# EAGLE design due canshield (EAGLE 9.3.0)
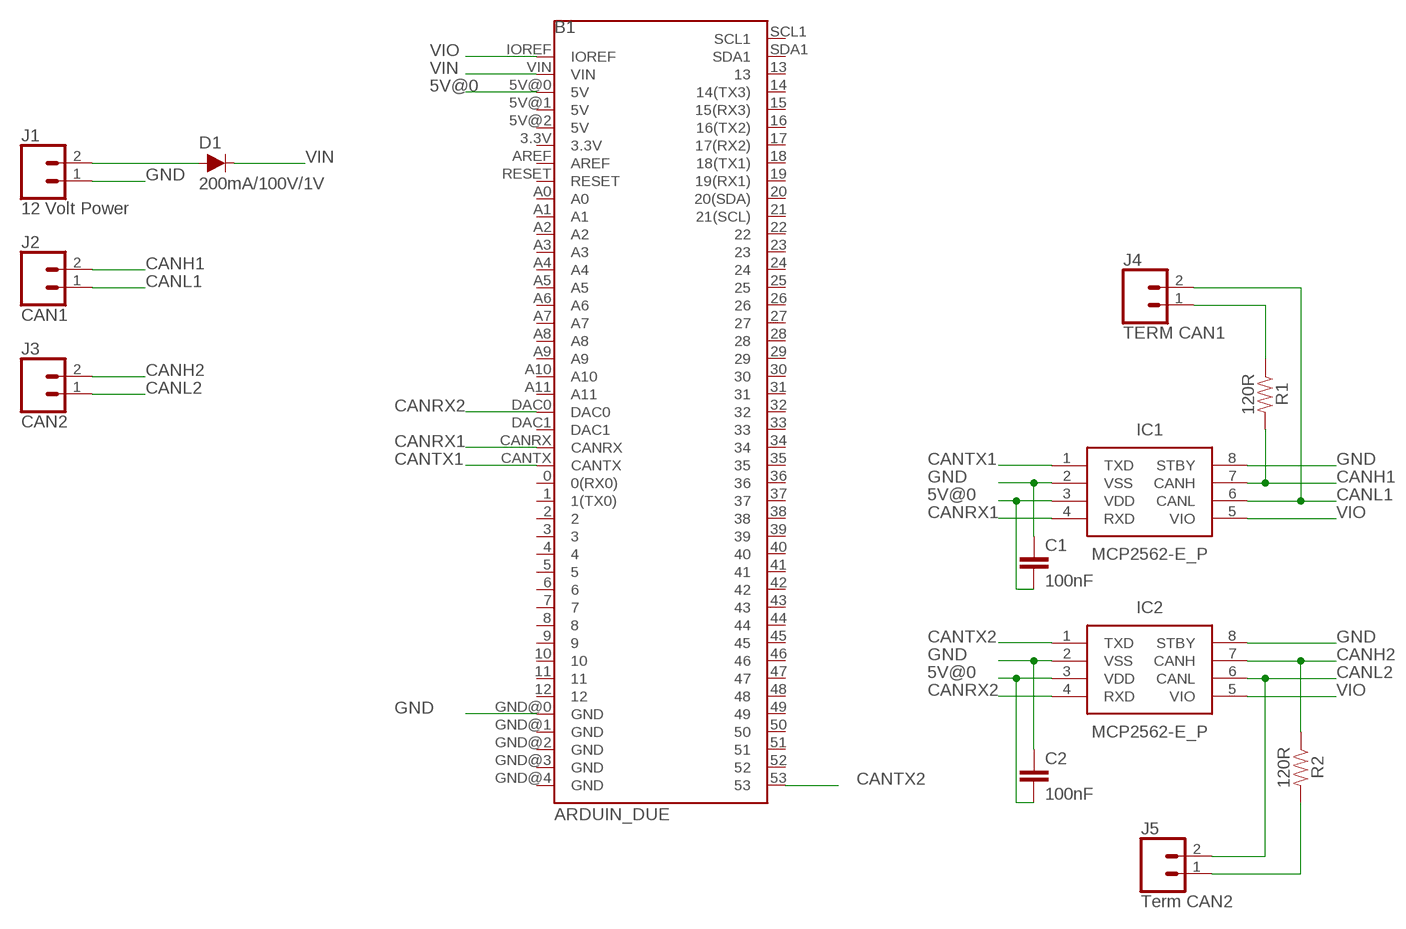
[diagram p0: schematic, sheet 1]

## Parts
B1  ARDUIN_DUE  [ARDUINODUE]
C1  100nF  10NF-PTH-10MM-10000V-1-%  [CAP-PTH-10MM]
C2  100nF  10NF-PTH-10MM-10000V-1-%  [CAP-PTH-10MM]
D1  200mA/100V/1V  DIODE-1N4148  [DIODE-1N4148]
IC1  MCP2562-E_P  [DIP781W56P254L950H533Q8N]
IC2  MCP2562-E_P  [DIP781W56P254L950H533Q8N]
J1  12 Volt Power  CONN_023.5MM  [SCREWTERMINAL-3.5MM-2]
J2  CAN1  CONN_023.5MM  [SCREWTERMINAL-3.5MM-2]
J3  CAN2  CONN_023.5MM  [SCREWTERMINAL-3.5MM-2]
J4  TERM CAN1  CONN_02LOCK_LONGPADS  [1X02_LOCK_LONGPADS]
J5  Term CAN2  CONN_02LOCK_LONGPADS  [1X02_LOCK_LONGPADS]
R1  120R  1KOHM-HORIZ-1/4W-5%  [AXIAL-0.3]
R2  120R  1KOHM-HORIZ-1/4W-5%  [AXIAL-0.3]

## Nets
5V@0: B1.5V@0(5V) C1.2 C2.2 IC1.3(VDD) IC2.3(VDD)
CANH1: IC1.7(CANH) J2.2 R1.P$2
CANH2: IC2.7(CANH) J3.2 R2.P$1
CANL1: IC1.6(CANL) J2.1 J4.2
CANL2: IC2.6(CANL) J3.1 J5.2
CANRX1: B1.CANRX IC1.4(RXD)
CANRX2: B1.DAC0 IC2.4(RXD)
CANTX1: B1.CANTX IC1.1(TXD)
CANTX2: B1.53 IC2.1(TXD)
GND: B1.GND@0(GND) C1.1 C2.1 IC1.2(VSS) IC1.8(STBY) IC2.2(VSS) IC2.8(STBY) J1.1
N$1: D1.A J1.2
N$2: J5.1 R2.P$2
N$3: J4.1 R1.P$1
VIN: B1.VIN D1.C
VIO: B1.IOREF IC1.5(VIO) IC2.5(VIO)
Unconnected: B1.0(0(RX0)) B1.1(1(TX0)) B1.2 B1.3 B1.3.3V B1.4 B1.5 B1.5V@1(5V) B1.5V@2(5V) B1.6 B1.7 B1.8 B1.9 B1.10 B1.11 B1.12 B1.13 B1.14(14(TX3)) B1.15(15(RX3)) B1.16(16(TX2)) B1.17(17(RX2)) B1.18(18(TX1)) B1.19(19(RX1)) B1.20(20(SDA)) B1.21(21(SCL)) B1.22 B1.23 B1.24 B1.25 B1.26 B1.27 B1.28 B1.29 B1.30 B1.31 B1.32 B1.33 B1.34 B1.35 B1.36 B1.37 B1.38 B1.39 B1.40 B1.41 B1.42 B1.43 B1.44 B1.45 B1.46 B1.47 B1.48 B1.49 B1.50 B1.51 B1.52 B1.A0 B1.A1 B1.A2 B1.A3 B1.A4 B1.A5 B1.A6 B1.A7 B1.A8 B1.A9 B1.A10 B1.A11 B1.AREF B1.DAC1 B1.GND@1(GND) B1.GND@2(GND) B1.GND@3(GND) B1.GND@4(GND) B1.RESET B1.SCL1 B1.SDA1

## Library data of the parts
B1 = Arduino Footprints:ARDUIN_DUE
C1 C2 = SparkFun-Capacitors:10NF: 0.01uF/10nF/10,000pF ceramic capacitors A capacitor is a passive two-terminal electrical component used to store electrical energy temporarily in an electric field. CAP-09321; PROD_ID: CAP-09321; VALUE: 10nF
D1 = SparkFun-DiscreteSemi:DIODE: Diode These are standard reverse protection diodes and small signal diodes. SparkFun Products: SparkFun SparkPunk Sound Kit <https://www.sparkfun.com/products/11177> SparkFun ESP8266 Thing <https://www.sparkfun.com/products/13231>; PROD_ID: DIO-08378
IC1 IC2 = SamacSys_Parts:MCP2562-E_P: CAN Transceiver 1Mbps 5V 125degC PDIP8 Microchip MCP2562-E/P, CAN Transceiver 1-channel IEC 61000-4-2, 8-Pin PDIP <https://componentsearchengine.com/Images/3/MCP2562-E_P.jpg> Source: Datasheet <http://uk.rs-online.com/webdocs/1380/0900766b81380aaf.pdf>; DESCRIPTION: CAN Transceiver 1Mbps 5V 125degC PDIP8 Microchip MCP2562-E/P, CAN Transceiver 1-channel IEC 61000-4-2, 8-Pin PDIP; HEIGHT: 5.334mm; MANUFACTURER_NAME: Microchip; MANUFACTURER_PART_NUMBER: MCP2562-E/P; RS_PART_NUMBER: 7990225; SUPPLIER_NAME: RS
J1-J3 = SparkFun-Retired:CONN_02: Multi connection point. Often used as Generic Header-pin footprint for 0.1 inch spaced/style header connections On any of the 0.1 inch spaced packages, you can populate with these: Break Away Headers - Straight <https://www.sparkfun.com/products/116> (PRT-00116) Break Away Male Headers - Right Angle <https://www.sparkfun.com/products/553> (PRT-00553) Female Headers <https://www.sparkfun.com/products/115> (PRT-00115) Break Away Headers - Machine Pin <https://www.sparkfun.com/products/117> (PRT-00117) Break Away Female Headers - Swiss Machine Pin <https://www.sparkfun.com/products/743> (PRT-00743) For SCREWTERMINALS and SPRING TERMINALS visit here: Screw Terimnals on SparkFun.com <https://www.sparkfun.com/search/results?term=Screw+Terminals> (5mm/3.5mm/2.54mm spacing) This device is also useful as a general connection point to wire up your design to another part of your project. Our various solder wires solder well into these plated through hole pads. Hook-Up Wire - Assortment (Stranded, 22 AWG) <https://www.sparkfun.com/products/11375> (PRT-11375) Hook-Up Wire - Assortment (Solid Core, 22 AWG) <https://www.sparkfun.com/products/11367> (PRT-11367) View the entire wire category on our website here <https://www.sparkfun.com/categories/141> Special notes: Molex polarized connector foot print use with: PRT-08233 with associated crimp pins and housings. 2.54_SCREWTERM for use with PRT-10571. 3.5mm Screw Terminal footprints for PRT-08084 5mm Screw Terminal footprints for use with PRT-08432; PROD_ID: CONN-08399
J4 J5 = SparkFun-Connectors:CONN_02: Multi connection point. Often used as Generic Header-pin footprint for 0.1 inch spaced/style header connections On any of the 0.1 inch spaced packages, you can populate with these: Break Away Headers - Straight <https://www.sparkfun.com/products/116> (PRT-00116) Break Away Male Headers - Right Angle <https://www.sparkfun.com/products/553> (PRT-00553) Female Headers <https://www.sparkfun.com/products/115> (PRT-00115) Break Away Headers - Machine Pin <https://www.sparkfun.com/products/117> (PRT-00117) Break Away Female Headers - Swiss Machine Pin <https://www.sparkfun.com/products/743> (PRT-00743) For SCREWTERMINALS and SPRING TERMINALS visit here: Screw Terimnals on SparkFun.com <https://www.sparkfun.com/search/results?term=Screw+Terminals> (5mm/3.5mm/2.54mm spacing) This device is also useful as a general connection point to wire up your design to another part of your project. Our various solder wires solder well into these plated through hole pads. Hook-Up Wire - Assortment (Stranded, 22 AWG) <https://www.sparkfun.com/products/11375> (PRT-11375) Hook-Up Wire - Assortment (Solid Core, 22 AWG) <https://www.sparkfun.com/products/11367> (PRT-11367) View the entire wire category on our website here <https://www.sparkfun.com/categories/141> Special notes: Molex polarized connector foot print use with: PRT-08233 with associated crimp pins and housings. 2.54_SCREWTERM for use with PRT-10571. 3.5mm Screw Terminal footprints for PRT-08084 5mm Screw Terminal footprints for use with PRT-08432
R1 R2 = SparkFun-Resistors:1KOHM: 1kΩ resistor A resistor is a passive two-terminal electrical component that implements electrical resistance as a circuit element. Resistors act to reduce current flow, and, at the same time, act to lower voltage levels within circuits. - Wikipedia; PROD_ID: RES-08380; VALUE: 1k

## Board
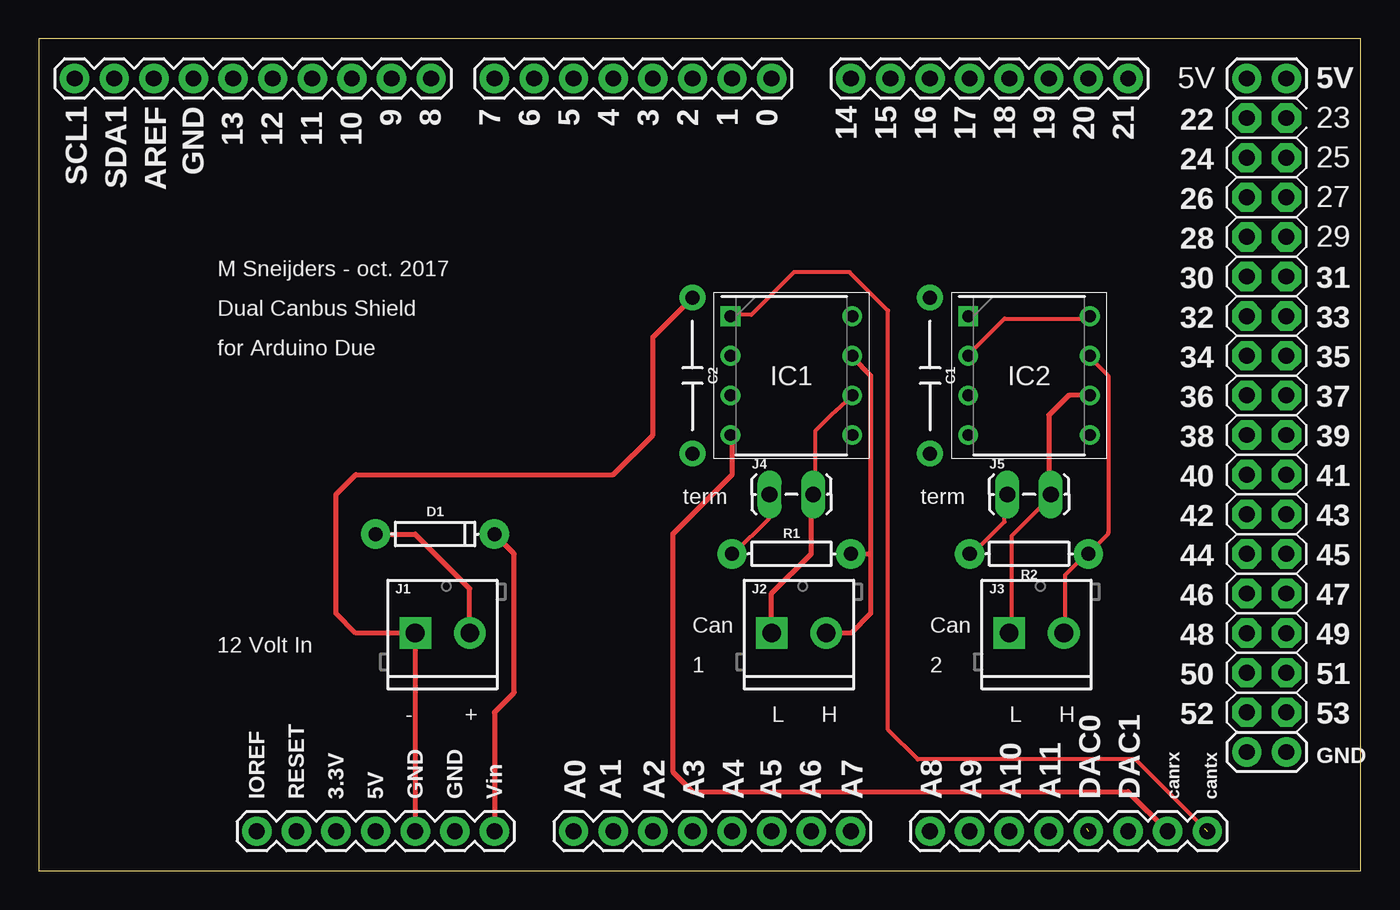
[diagram p1: board, top side]
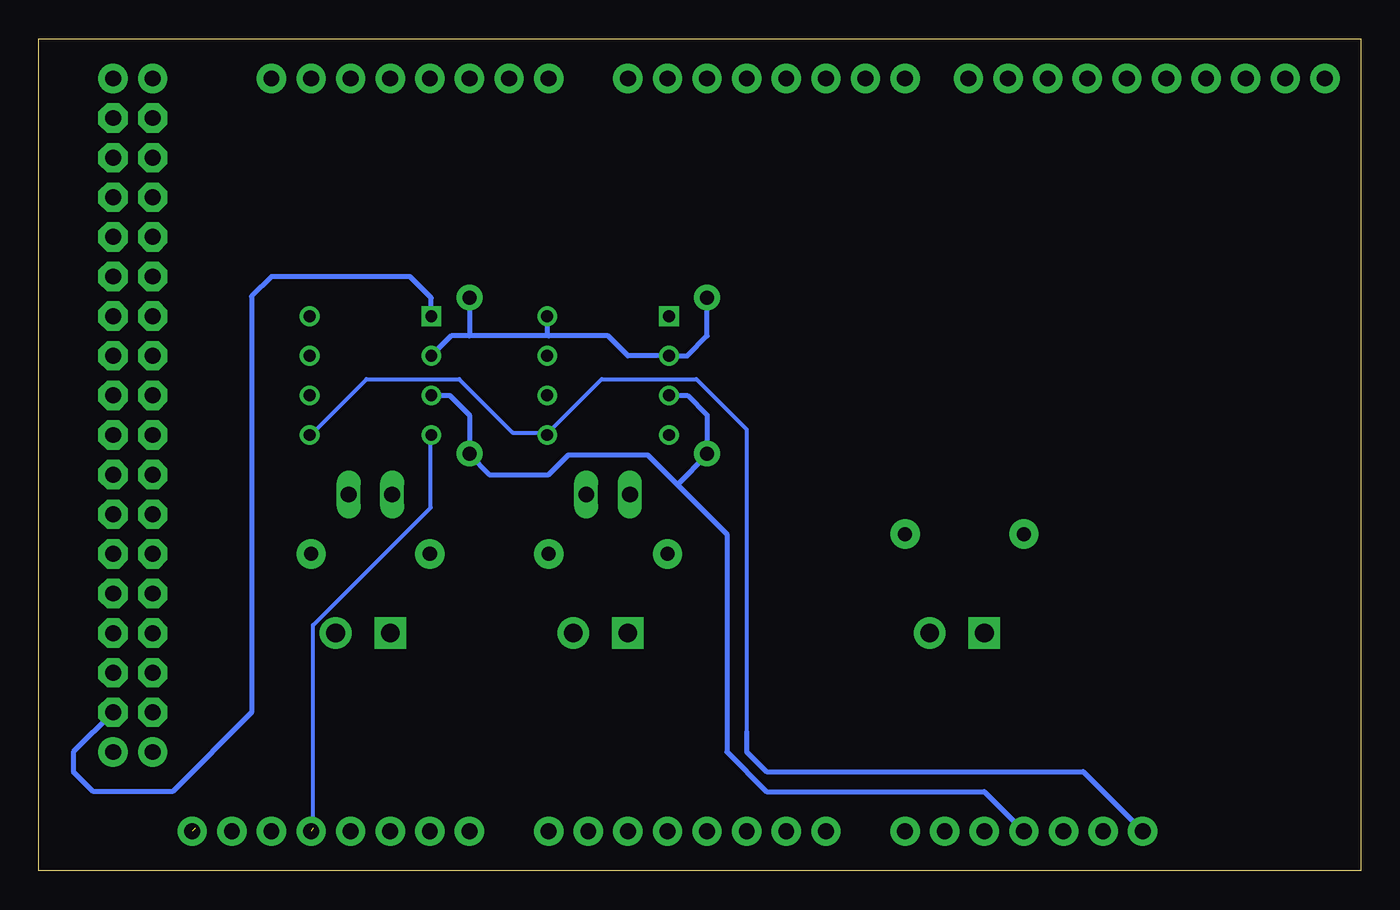
[diagram p2: board, bottom side, seen from below]

Size 84.76 x 53.33 mm. Coordinates in mm from the lower left corner, seen from the top.
Outline: 0,0 84.76,0 84.76,53.33 0,53.33 0,0
Copper layers (1*16): Top 0.035mm / dielectric 1.5mm / Bottom 0.035mm
Design rules "default": minimum track width 10mil, minimum drill 24mil, track to track 8mil, track to pad 8mil, pad to pad 8mil, via to via 8mil, smd to smd 8mil, copper to edge 40mil, drill to drill 8mil, minimum pad ring 10mil, minimum via ring 8mil, stop-mask expansion 4mil, vias tented up to drill 0mil, thermal gap 10mil

### Footprints (pad centres in the part's own frame; a part is rotated, then mirrored left to right if it is on the bottom)
ARDUINODUE = drill 1.016 pad 1.88: 0 10.16,24.13; 1 7.62,24.13; 2 5.08,24.13; 3 2.54,24.13; 3.3V -17.78,-24.13; 4 0,24.13; 5 -2.54,24.13; 5V@0 -15.24,-24.13; 5V@1 40.64,24.13; 5V@2 43.18,24.13; 6 -5.08,24.13; 7 -7.62,24.13; 8 -11.684,24.13; 9 -14.224,24.13; 10 -16.764,24.13; 11 -19.304,24.13; 12 -21.844,24.13; 13 -24.384,24.13; 14 15.24,24.13; 15 17.78,24.13; 16 20.32,24.13; 17 22.86,24.13; 18 25.4,24.13; 19 27.94,24.13; 20 30.48,24.13; 21 33.02,24.13; A0 -2.54,-24.13; A1 0,-24.13; A2 2.54,-24.13; A3 5.08,-24.13; A4 7.62,-24.13; A5 10.16,-24.13; A6 12.7,-24.13; A7 15.24,-24.13; A8 20.32,-24.13; A9 22.86,-24.13; A10 25.4,-24.13; A11 27.94,-24.13; AREF -29.464,24.13; CANRX 35.56,-24.13; CANTX 38.1,-24.13; DAC0 30.48,-24.13; DAC1 33.02,-24.13; GND@0 -12.7,-24.13; GND@1 -10.16,-24.13; GND@2 40.64,-19.05; GND@3 43.18,-19.05; GND@4 -26.924,24.13; IOREF -22.86,-24.13; RESET -20.32,-24.13; SCL1 -34.544,24.13; SDA1 -32.004,24.13; VIN -7.62,-24.13 | drill 1.016 pad 1.88 octagon: 22 40.64,21.59; 23 43.18,21.59; 24 40.64,19.05; 25 43.18,19.05; 26 40.64,16.51; 27 43.18,16.51; 28 40.64,13.97; 29 43.18,13.97; 30 40.64,11.43; 31 43.18,11.43; 32 40.64,8.89; 33 43.18,8.89; 34 40.64,6.35; 35 43.18,6.35; 36 40.64,3.81; 37 43.18,3.81; 38 40.64,1.27; 39 43.18,1.27; 40 40.64,-1.27; 41 43.18,-1.27; 42 40.64,-3.81; 43 43.18,-3.81; 44 40.64,-6.35; 45 43.18,-6.35; 46 40.64,-8.89; 47 43.18,-8.89; 48 40.64,-11.43; 49 43.18,-11.43; 50 40.64,-13.97; 51 43.18,-13.97; 52 40.64,-16.51; 53 43.18,-16.51
CAP-PTH-10MM = drill 0.9 pad 1.651: 1 -5,0; 2 5,0
DIODE-1N4148 = drill 0.9 pad 1.88: A -3.81,0; C 3.81,0
DIP781W56P254L950H533Q8N = drill 0.759 pad 1.159 square: 1 -3.905,3.81 | drill 0.759 pad 1.159: 2 -3.905,1.27; 3 -3.905,-1.27; 4 -3.905,-3.81; 5 3.905,-3.81; 6 3.905,-1.27; 7 3.905,1.27; 8 3.905,3.81
SCREWTERMINAL-3.5MM-2 = drill 1.2 pad 2.032 square: 1 0,0 | drill 1.2 pad 2.032: 2 3.5,0
1X02_LOCK_LONGPADS = drill 1.016 long: 1 -0.127,0; 2 2.667,0
AXIAL-0.3 = drill 0.9 pad 1.88: P$1 -3.81,0; P$2 3.81,0

### Placement (x,y rotation side)
B1  36.83,26.67 0 top
C1  57.15,31.75 270 top
C2  41.91,31.75 270 top
D1  25.4,21.59 0 top
IC1  48.26,31.75 0 top
IC2  63.5,31.75 0 top
J1  24.13,15.24 0 top
J2  46.99,15.24 0 top
J3  62.23,15.24 0 top
J4  46.99,24.13 0 top
J5  62.23,24.13 0 top
R1  1k  [AXIAL-0.3]  48.26,20.32 0 top
R2  1k  [AXIAL-0.3]  63.5,20.32 180 top

### Tracks (layer width: path | path; a pad name or v marks a point on that pad's centre or on a via)
5V@0
  Bottom 0.305: IC2.3 58.42,30.48 57.15,29.21 C1.2 57.15,26.67 55.88,25.4 52.07,25.4 50.8,26.67 45.72,26.67 43.81,24.77 | 43.81,24.77 40.64,21.59 40.64,7.62 38.1,5.08 24.13,5.08 B1.5V@0 | 43.81,24.77 41.91,26.67 C2.2 41.91,29.21 43.18,30.48 IC1.3
CANH1
  Top 0.305: IC1.7 52.17,32.93 53.34,31.75 53.34,20.32 | 53.34,20.32 53.34,16.51 52.07,15.24 J2.2 | R1.P$2 53.34,20.32
CANH2
  Top 0.254: J3.2 65.81,15.29 65.81,18.95 67.18,20.32 R2.P$1 68.51,21.52 arc45 68.58,21.7 68.58,31.75 67.47,32.86 arc-45 IC2.7
CANL1
  Top 0.254: IC1.6 52.09,30.38 50.83,29.23 49.81,28.22 49.81,24.21 J4.2
  Top 0.305: J2.1 46.99,17.78 49.53,20.32 49.53,24 J4.2
CANL2
  Top 0.254: J3.1 62.38,15.29 62.38,21.46 64.9,23.98 J5.2
  Top 0.305: IC2.6 66.04,30.48 64.77,29.21 64.77,24.26 J5.2
CANRX1
  Top 0.305: IC1.4 44.45,27.94 44.45,25.4 40.64,21.59 40.64,6.35 41.91,5.08 69.85,5.08 B1.CANRX
CANRX2  (1 unrouted)
  Bottom 0.254: 67.18,2.72 67.18,15.75 59.64,23.29 59.64,27.86 IC2.4
CANTX1  (1 unrouted)
  Top 0.254: 74.73,2.72 70.31,7.14 56.36,7.14 54.46,9.04 54.46,35.92 51.99,38.38 48.44,38.38 45.7,35.64 44.55,35.64 IC1.1
CANTX2
  Bottom 0.305: IC2.1 59.59,36.73 60.96,38.1 69.85,38.1 71.12,36.83 71.12,10.16 76.2,5.08 81.28,5.08 82.55,6.35 82.55,7.62 B1.53
GND
  Top 0.254: IC2.8 67.18,35.41 61.92,35.41 59.64,33.12 IC2.2
  Top 0.305: C2.1 39.37,34.21 39.37,27.94 36.83,25.4 20.32,25.4 19.05,24.13 19.05,16.51 20.32,15.24 J1.1 B1.GND@0
  Bottom 0.254: 44.32,33.12 IC1.2
  Bottom 0.305: 44.45,33.02 IC1.2 43.18,33.02 41.91,34.29 C2.1 | 44.45,33.02 46.99,33.02 48.26,34.29 52.07,34.29 | 52.07,34.29 57.15,34.29 | 57.15,34.29 58.33,34.29 IC2.2 | IC1.8 52.17,34.38 52.07,34.29 | 44.32,33.12 44.35,33.12 44.45,33.02 | C1.1 57.15,34.29
N$1
  Top 0.305: J1.2 27.63,18.09 24.13,21.59 D1.A
N$2
  Top 0.254: J5.1 61.92,23.98 61.92,22.38 59.87,20.32 R2.P$2
N$3
  Top 0.254: J4.1 46.84,23.98 46.84,22.61 44.55,20.32 R1.P$1
VIN
  Top 0.305: D1.C 30.48,20.32 30.48,11.43 29.21,10.16 B1.VIN
VIO
  Bottom 0.254: IC2.5 67.18,28.09 63.75,31.52 57.81,31.52 54.38,28.09 52.32,28.09 IC1.5 52.09,28.09 48.67,31.52 42.6,31.52 39.37,28.3 39.37,8.89
  Bottom 0.305: 39.37,8.89 39.37,7.62 38.1,6.35 17.78,6.35 B1.IOREF

### Text on the board
tPlace: M Sneijders - oct. 2017 | Dual Canbus Shield | for Arduino Due | term | term | Can | Can | 12 Volt In | 1 | 2 | - | + | L | H | L | H